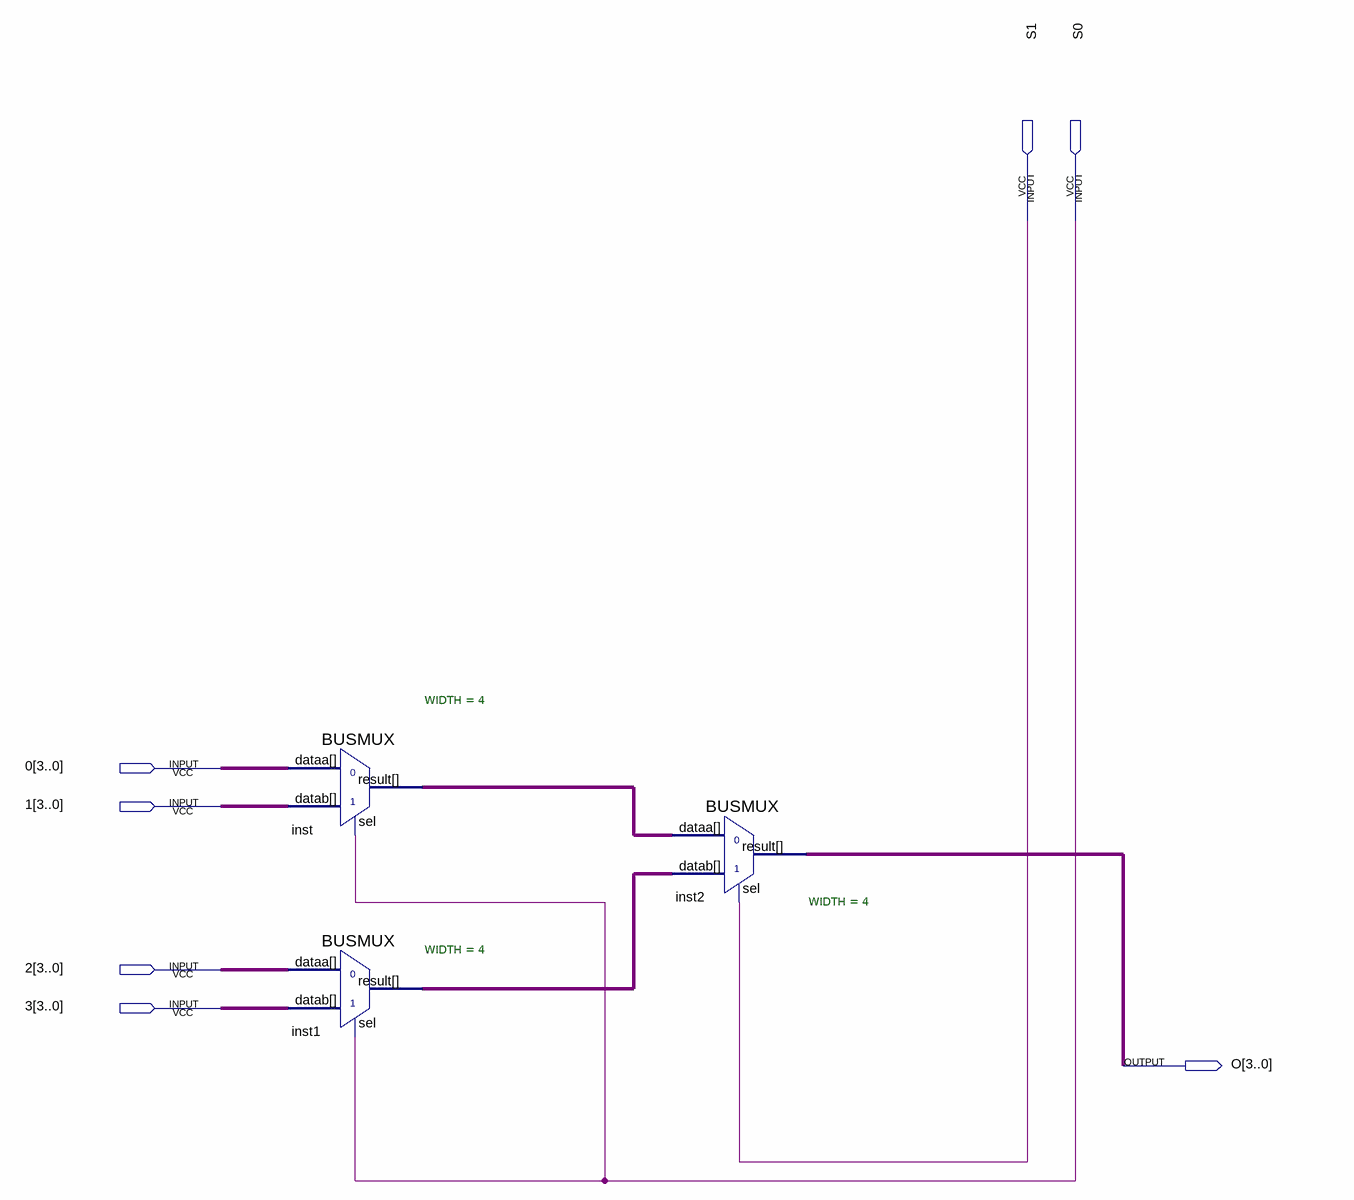
[diagram p0: schematic sheet]
// Quartus schematic Mux4x1.bdf as structural Verilog: 3 symbols, 7 pins
module Mux4x1 (
  input  S1,
  input  S0,
  input  [3:0] \0 ,
  input  [3:0] \1 ,
  input  [3:0] \2 ,
  input  [3:0] \3 ,
  output [3:0] O
);

  wire [3:0] inst1_result, inst_result;

  BUSMUX #(.WIDTH(4)) inst (.datab(\1 ), .sel(S0), .dataa(\0 ), .result(inst_result));
  BUSMUX #(.WIDTH(4)) inst1 (.datab(\3 ), .sel(S0), .dataa(\2 ), .result(inst1_result));
  BUSMUX #(.WIDTH(4)) inst2 (.datab(inst1_result), .sel(S1), .dataa(inst_result), .result(O));
endmodule
